# EasyEDA schematic BIT 6.json
TITLE: TRICORE | ALU | LOGIC; REV: 1.0; Date: 2022-01-03; Sheet: 8/9; Drawn By: Koehler, Paul; Company: komed3
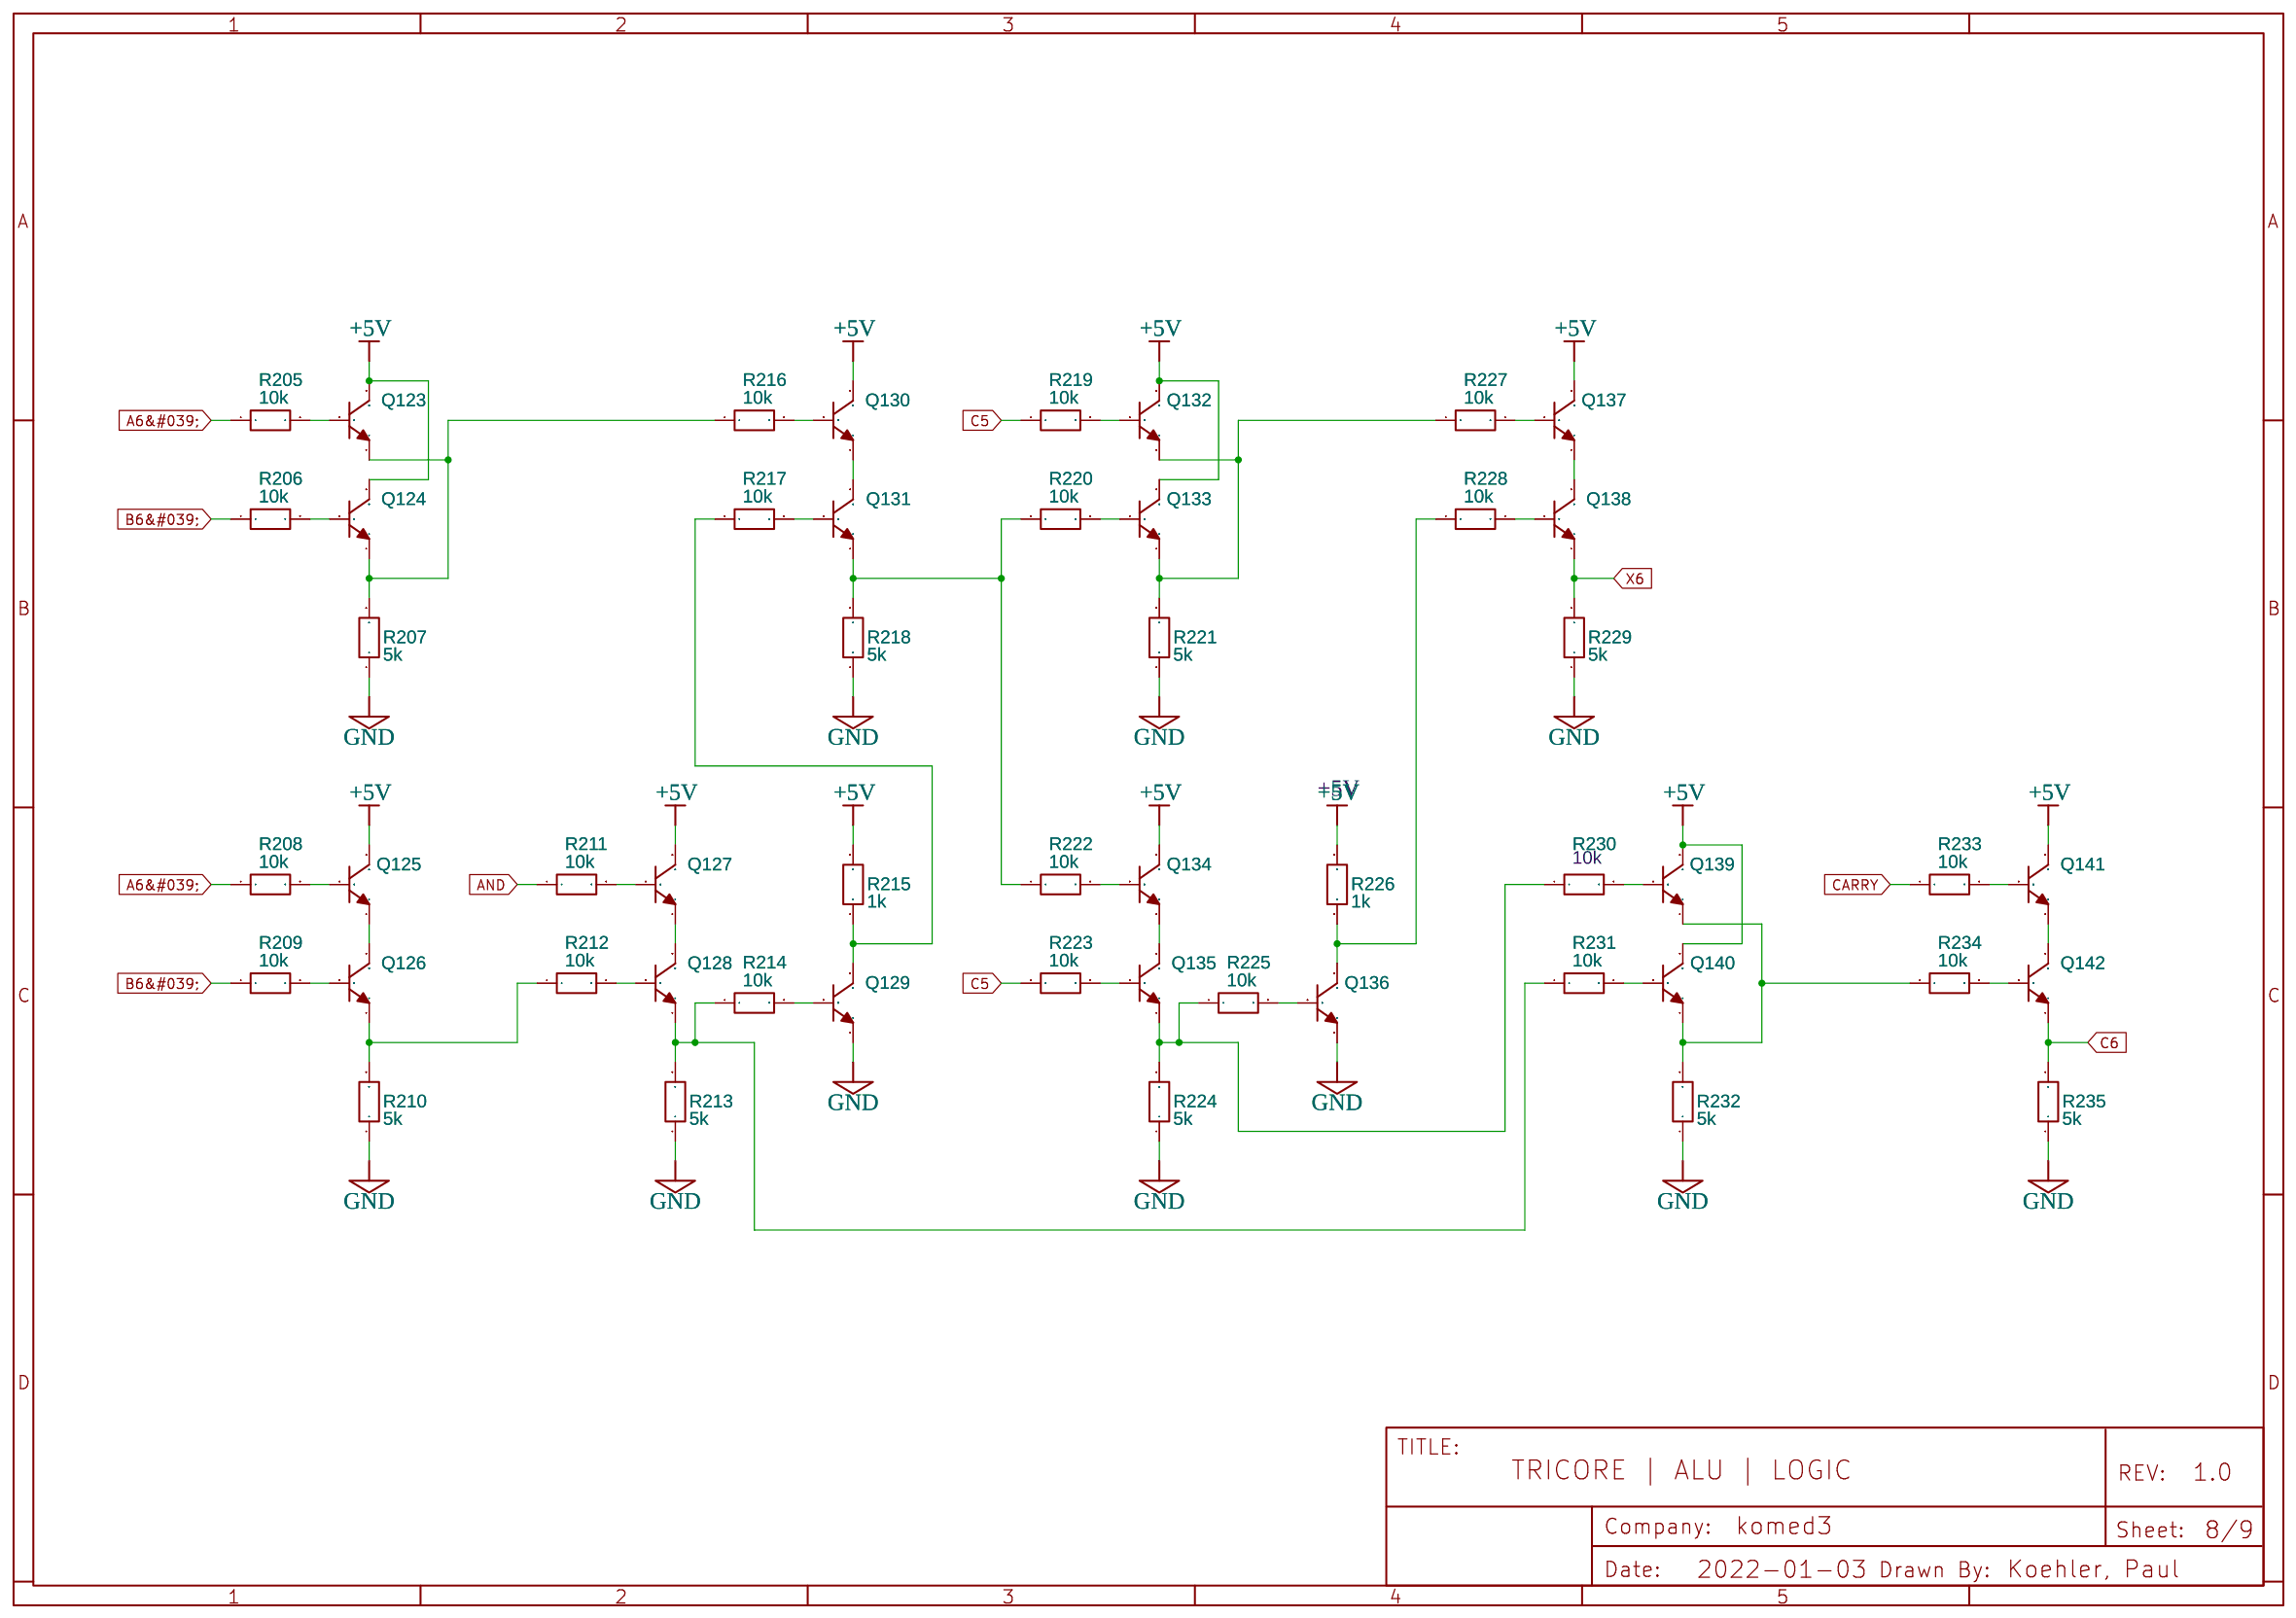
[diagram p0: schematic sheet]

## Parts
Q123  2N3904(TO-92)  [TO-92-3_L5.1-W4.1-P1.27-L]
Q124  2N3904(TO-92)  [TO-92-3_L5.1-W4.1-P1.27-L]
Q125  2N3904(TO-92)  [TO-92-3_L5.1-W4.1-P1.27-L]
Q126  2N3904(TO-92)  [TO-92-3_L5.1-W4.1-P1.27-L]
Q127  2N3904(TO-92)  [TO-92-3_L5.1-W4.1-P1.27-L]
Q128  2N3904(TO-92)  [TO-92-3_L5.1-W4.1-P1.27-L]
Q129  2N3904(TO-92)  [TO-92-3_L5.1-W4.1-P1.27-L]
Q130  2N3904(TO-92)  [TO-92-3_L5.1-W4.1-P1.27-L]
Q131  2N3904(TO-92)  [TO-92-3_L5.1-W4.1-P1.27-L]
Q132  2N3904(TO-92)  [TO-92-3_L5.1-W4.1-P1.27-L]
Q133  2N3904(TO-92)  [TO-92-3_L5.1-W4.1-P1.27-L]
Q134  2N3904(TO-92)  [TO-92-3_L5.1-W4.1-P1.27-L]
Q135  2N3904(TO-92)  [TO-92-3_L5.1-W4.1-P1.27-L]
Q136  2N3904(TO-92)  [TO-92-3_L5.1-W4.1-P1.27-L]
Q137  2N3904(TO-92)  [TO-92-3_L5.1-W4.1-P1.27-L]
Q138  2N3904(TO-92)  [TO-92-3_L5.1-W4.1-P1.27-L]
Q139  2N3904(TO-92)  [TO-92-3_L5.1-W4.1-P1.27-L]
Q140  2N3904(TO-92)  [TO-92-3_L5.1-W4.1-P1.27-L]
Q141  2N3904(TO-92)  [TO-92-3_L5.1-W4.1-P1.27-L]
Q142  2N3904(TO-92)  [TO-92-3_L5.1-W4.1-P1.27-L]
R205  10k  [R_AXIAL-0.3]
R206  10k  [R_AXIAL-0.3]
R207  5k  [R_AXIAL-0.3]
R208  10k  [R_AXIAL-0.3]
R209  10k  [R_AXIAL-0.3]
R210  5k  [R_AXIAL-0.3]
R211  10k  [R_AXIAL-0.3]
R212  10k  [R_AXIAL-0.3]
R213  5k  [R_AXIAL-0.3]
R214  10k  [R_AXIAL-0.3]
R215  1k  [R_AXIAL-0.3]
R216  10k  [R_AXIAL-0.3]
R217  10k  [R_AXIAL-0.3]
R218  5k  [R_AXIAL-0.3]
R219  10k  [R_AXIAL-0.3]
R220  10k  [R_AXIAL-0.3]
R221  5k  [R_AXIAL-0.3]
R222  10k  [R_AXIAL-0.3]
R223  10k  [R_AXIAL-0.3]
R224  5k  [R_AXIAL-0.3]
R225  10k  [R_AXIAL-0.3]
R226  1k  [R_AXIAL-0.3]
R227  10k  [R_AXIAL-0.3]
R228  10k  [R_AXIAL-0.3]
R229  5k  [R_AXIAL-0.3]
R230  R224W  [R_AXIAL-0.3]
R231  10k  [R_AXIAL-0.3]
R232  5k  [R_AXIAL-0.3]
R233  10k  [R_AXIAL-0.3]
R234  10k  [R_AXIAL-0.3]
R235  5k  [R_AXIAL-0.3]

## Library data of the parts
Q123-Q142 = 2N3904(TO-92): Supplier: LCSC; Manufacturer: SEMTECH; Manufacturer Part: 2N3904; Supplier Part: C118538; Contributor: LCEDA_Lib
R205-R235 = R_AXIAL-0.3_EU: Contributor: LCEDA_Lib

## Nets
+5V: Q123.3(C) Q124.3(C) Q125.3(C) Q127.3(C) Q130.3(C) Q132.3(C) Q133.3(C) Q134.3(C) Q137.3(C) Q139.3(C) Q140.3(C) Q141.3(C) R215.2 R226.2
GND: Q129.1(E) Q136.1(E) R207.1 R210.1 R213.1 R218.1 R221.1 R224.1 R229.1 R232.1 R235.1
A6&#039;: R205.1 R208.1
AND: R211.1
B6&#039;: R206.1 R209.1
C5: R219.1 R223.1
C6: Q142.1(E) R235.2
CARRY: R233.1
X6: Q138.1(E) R229.2
Net-(Q123-1): Q123.1(E) Q124.1(E) R207.2 R216.1
Net-(Q123-2): Q123.2(B) R205.2
Net-(Q124-2): Q124.2(B) R206.2
Net-(Q125-1): Q125.1(E) Q126.3(C)
Net-(Q125-2): Q125.2(B) R208.2
Net-(Q126-1): Q126.1(E) R210.2 R212.1
Net-(Q126-2): Q126.2(B) R209.2
Net-(Q127-1): Q127.1(E) Q128.3(C)
Net-(Q127-2): Q127.2(B) R211.2
Net-(Q128-1): Q128.1(E) R213.2 R214.1 R231.1
Net-(Q128-2): Q128.2(B) R212.2
Net-(Q129-2): Q129.2(B) R214.2
Net-(Q129-3): Q129.3(C) R215.1 R217.1
Net-(Q130-1): Q130.1(E) Q131.3(C)
Net-(Q130-2): Q130.2(B) R216.2
Net-(Q131-1): Q131.1(E) R218.2 R220.1 R222.1
Net-(Q131-2): Q131.2(B) R217.2
Net-(Q132-1): Q132.1(E) Q133.1(E) R221.2 R227.1
Net-(Q132-2): Q132.2(B) R219.2
Net-(Q133-2): Q133.2(B) R220.2
Net-(Q134-1): Q134.1(E) Q135.3(C)
Net-(Q134-2): Q134.2(B) R222.2
Net-(Q135-1): Q135.1(E) R224.2 R225.1 R230.1
Net-(Q135-2): Q135.2(B) R223.2
Net-(Q136-2): Q136.2(B) R225.2
Net-(Q136-3): Q136.3(C) R226.1 R228.1
Net-(Q137-1): Q137.1(E) Q138.3(C)
Net-(Q137-2): Q137.2(B) R227.2
Net-(Q138-2): Q138.2(B) R228.2
Net-(Q139-1): Q139.1(E) Q140.1(E) R232.2 R234.1
Net-(Q139-2): Q139.2(B) R230.2
Net-(Q140-2): Q140.2(B) R231.2
Net-(Q141-1): Q141.1(E) Q142.3(C)
Net-(Q141-2): Q141.2(B) R233.2
Net-(Q142-2): Q142.2(B) R234.2

## Notes on the sheet
- +5V
- 10k
